# EAGLE schematic Dual Power Supply design (EAGLE 9.6.2)
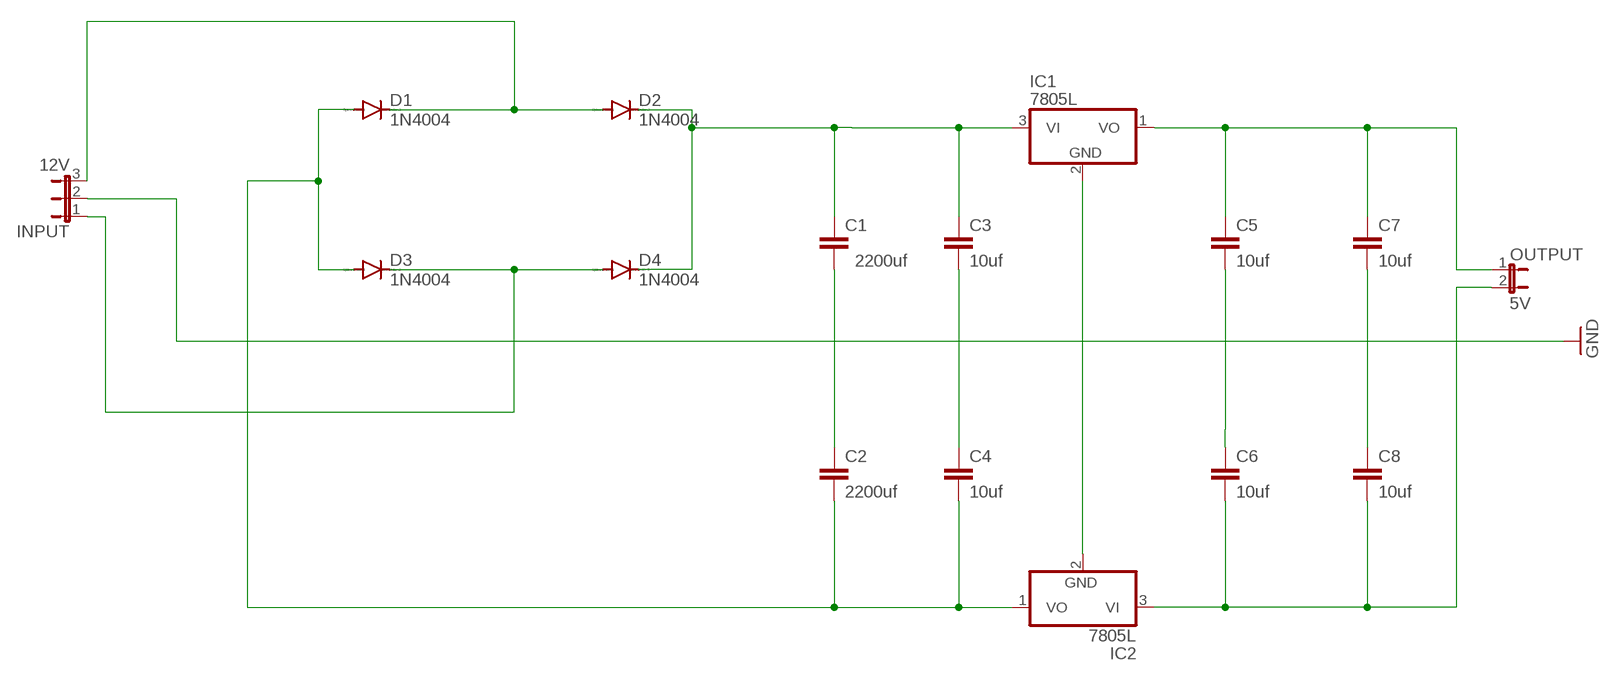
[diagram p0: schematic, sheet 1]

## Parts
C1  2200uf  C2,5-3  [C2.5-3]
C2  2200uf  C2,5-3  [C2.5-3]
C3  10uf  C2,5-3  [C2.5-3]
C4  10uf  C2,5-3  [C2.5-3]
C5  10uf  C2,5-3  [C2.5-3]
C6  10uf  C2,5-3  [C2.5-3]
C7  10uf  C2,5-3  [C2.5-3]
C8  10uf  C2,5-3  [C2.5-3]
D1  1N4004  [DO41-10]
D2  1N4004  [DO41-10]
D3  1N4004  [DO41-10]
D4  1N4004  [DO41-10]
IC1  7805L  [TO92]
IC2  7805L  [TO92]
INPUT  12V  JP2E  [JP2]
OUTPUT  5V  JP1E  [JP1]

## Nets
GND: INPUT.2
N$1: C1.2 C2.1
N$2: D1.C D2.A INPUT.3
N$3: C1.1 C3.1 D2.C D4.C IC1.3(VI)
N$4: C2.2 C4.2 D1.A D3.A IC2.1(VO)
N$5: D3.C D4.A INPUT.1
N$6: C3.2 C4.1
N$7: C5.1 C7.1 IC1.1(VO) OUTPUT.1
N$9: C6.2 C8.2 IC2.3(VI) OUTPUT.2
N$10: IC1.2(GND) IC2.2(GND)
N$11: C7.2 C8.1
N$12: C5.2 C6.1

## Library data of the parts
C1-C8 = capacitor-wima:C: CAPACITOR naming: grid - package width
D1-D4 = diode:1N4004: DIODE general purpose rectifier, 1 A
IC1 IC2 = linear:78*: Positive VOLTAGE REGULATOR Source: http://cache.national.com/ds/LM/LM78L05.pdf http://www.fairchildsemi.com/ds/LM/LM7805.pdf
INPUT = jumper:JP2E: JUMPER
OUTPUT = jumper:JP1E: JUMPER